# EAGLE schematic Motorplatine (EAGLE 7.2.0)
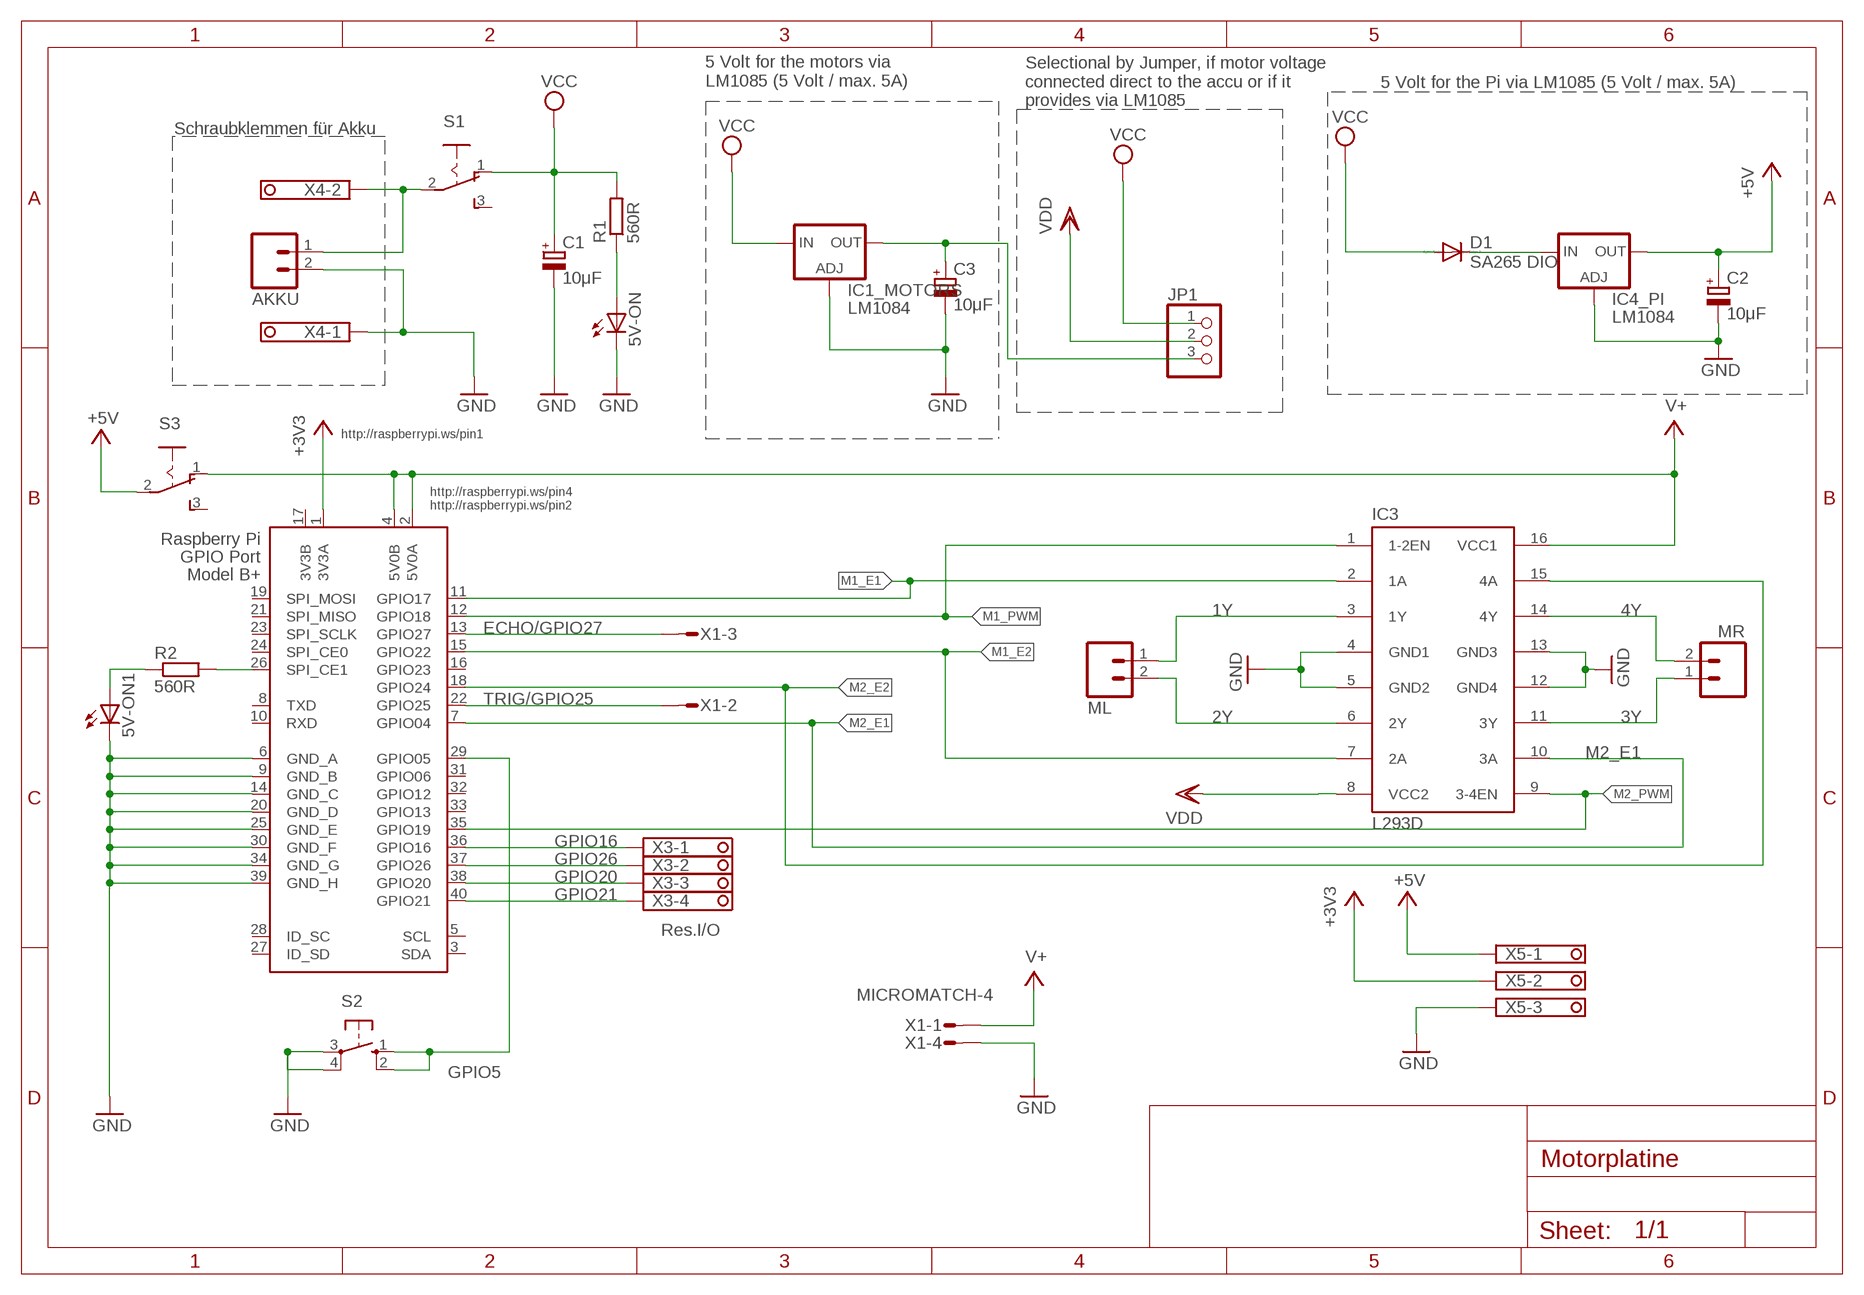
[diagram p0: schematic, sheet 1]

## Parts
5V-ON  LEDSML1206  [SML1206]
5V-ON1  LEDSML1206  [SML1206]
AKKU  MA02  [02PA]
C1  10μF  CPOL-EUCT3528  [CT3528]
C2  10μF  CPOL-EUCT3528  [CT3528]
C3  10μF  CPOL-EUCT3528  [CT3528]
D1  SA265 DIO  DIODE-MELF-MLL41  [MELF-MLL41]
IC1_MOTORS  LM1084  LM317TL  [317TL]
IC3  L293D  [DIL16]
IC4_PI  LM1084  LM317TL  [317TL]
JP1  PINHD-1X3  [1X03]
ML  MA02  [02PA]
MR  MA02  [02PA]
R1  560R  R-EU_R1206  [R1206]
R2  560R  R-EU_R1206  [R1206]
S1  255SB  [255SB]
S2  10-XX  [B3F-10XX]
S3  255SB  [255SB]
X1  MICROMATCH-4  [MICROMATCH-4]
X2  RASPI_GPIO_B+#_PIN  [RASPI_GPIO_B+_PIN]
X3  1751264  [1751264]
X4  1751248  [1751248]
X5  1751251  [1751251]

## Nets
1Y: IC3.3(1Y) ML.1
2Y: IC3.6(2Y) ML.2
3Y: IC3.11(3Y) MR.1
4Y: IC3.14(4Y) MR.2
+3V3: X2.1(3V3A) X5.2
+5V: C2.+ IC4_PI.2(OUT) S3.2(P) X5.1
ECHO/GPIO27: X1.3 X2.13(GPIO27)
GND: 5V-ON1.C 5V-ON.C AKKU.2 C1.- C2.- C3.- IC1_MOTORS.1(ADJ) IC3.4(GND1) IC3.5(GND2) IC3.12(GND4) IC3.13(GND3) IC4_PI.1(ADJ) S2.3(P) S2.4(P1) X1.4 X2.6(GND_A) X2.9(GND_B) X2.14(GND_C) X2.20(GND_D) X2.25(GND_E) X2.30(GND_F) X2.34(GND_G) X2.39(GND_H) X4.1 X5.3
GPIO5: S2.1(S) S2.2(S1) X2.29(GPIO05)
GPIO16: X2.36(GPIO16) X3.1
GPIO20: X2.38(GPIO20) X3.3
GPIO21: X2.40(GPIO21) X3.4
GPIO26: X2.37(GPIO26) X3.2
M1_E1: IC3.2(1A) X2.11(GPIO17)
M1_E2: IC3.7(2A) X2.15(GPIO22)
M1_PWM: IC3.1(1-2EN) X2.12(GPIO18)
M2_E1: IC3.10(3A) X2.7(GPIO04)
M2_E2: IC3.15(4A) X2.18(GPIO24)
M2_PWM: IC3.9(3-4EN) X2.35(GPIO19)
N$1: 5V-ON1.A R2.1
N$2: R2.2 X2.26(SPI_CE1)
N$3: C3.+ IC1_MOTORS.2(OUT) JP1.3
N$5: AKKU.1 S1.2(P) X4.2
N$7: D1.C IC4_PI.3(IN)
N$12: 5V-ON.A R1.1
TRIG/GPIO25: X1.2 X2.22(GPIO25)
V+: IC3.16(VCC1) S3.1(O) X1.1 X2.2(5V0A) X2.4(5V0B)
VCC: C1.+ D1.A IC1_MOTORS.3(IN) JP1.1 R1.2 S1.1(O)
VDD: IC3.8(VCC2) JP1.2
Unconnected: S1.3(S) S3.3(S) X2.3(SDA) X2.5(SCL) X2.8(TXD) X2.10(RXD) X2.16(GPIO23) X2.19(SPI_MOSI) X2.21(SPI_MISO) X2.23(SPI_SCLK) X2.24(SPI_CE0) X2.27(ID_SD) X2.28(ID_SC) X2.31(GPIO06) X2.32(GPIO12) X2.33(GPIO13)

## Notes on the sheet
- 5 Volt for the motors via
  LM1085 (5 Volt / max. 5A)
- 5 Volt for the Pi via LM1085 (5 Volt / max. 5A)
- Selectional by Jumper, if motor voltage
  connected direct to the accu or if it
  provides via LM1085
- Schraubklemmen für Akku
- http://raspberrypi.ws/pin1
- http://raspberrypi.ws/pin4
  http://raspberrypi.ws/pin2
- Res.I/O

## Power pins joined to a net without a drawn wire
3V3B: X2.17(3V3B)

## Library data of the parts
5V-ON 5V-ON1 = led-Task:LED: LED-RM
AKKU ML MR = con-amp-quick:MA02: AMP QUICK CONNECTOR; OC_FARNELL: unknown; OC_NEWARK: unknown
C1-C3 = rcl:CPOL-EU: POLARIZED CAPACITOR, European symbol
D1 = diode:DIODE-: DIODE
IC1_MOTORS IC4_PI = Spg.reg:LM317TL: VOLTAGE REGULATOR
IC3 = st-microelectronics:L293D: PUSH-PULL 4 CHANNEL DRIVER; MPN: L293D; OC_FARNELL: 9589619; OC_NEWARK: 56P8249
JP1 = pinhead:PINHD-1X3: PIN HEADER
R1 R2 = Widerstände:R-EU_: RESISTOR; SPICEPREFIX: R
S1 S3 = switch:255SB: SLIDING SWITCH Distributor Buerklin, 11G810
S2 = switch-omron:10-XX: OMRON SWITCH; MPN: B3F-1000; OC_FARNELL: 176432; OC_NEWARK: 36M3542
X1 = con-amp-micromatch:MICROMATCH-4: MicroMaTch 4 7-215464-4 / 0-215464-4 Drawing Number C-215464 DDEController.pdf; MPN: 7-215464-4; OC_FARNELL: 3784629; OC_NEWARK: 19R8124
X2 = raspberrypi_bastelstube_v13:RASPI_GPIO_B+#: 2x20 header connector, all pins connected
X3 = Con-2-10-RM3,5:1751264: MKDS 1/ 4-3,5 Printklemme Nennstrom: 10 A Bemessungsspannung: 160 V Raster: 3,5 mm Polzahl: 4 Montageart: Löten Anschlussart: Schraubanschluss Anschlussrichtung vom Leiter zur Platine: 0° Source: http://eshop.phoenixcontact.com .. 1751264.pdf; MPN: 1751264; OC_FARNELL: unknown; OC_NEWARK: 10R0934
X4 = con-phoenix-350:1751248: MKDS 1/ 2-3,5 Printklemme Nennstrom: 10 A Bemessungsspannung: 160 V Raster: 3,5 mm Polzahl: 2 Montageart: Löten Anschlussart: Schraubanschluss Anschlussrichtung vom Leiter zur Platine: 0° Source: http://eshop.phoenixcontact.com .. 1751248.pdf; OC_FARNELL: unknown; OC_NEWARK: unknown
X5 = Con-2-10-RM3,5:1751251: MKDS 1/ 3-3,5 Printklemme Nennstrom: 10 A Bemessungsspannung: 160 V Raster: 3,5 mm Polzahl: 3 Montageart: Löten Anschlussart: Schraubanschluss Anschlussrichtung vom Leiter zur Platine: 0° Source: http://eshop.phoenixcontact.com .. 1751251.pdf; OC_FARNELL: unknown; OC_NEWARK: unknown